# Altium schematic sheet Main.SchDoc
size A1
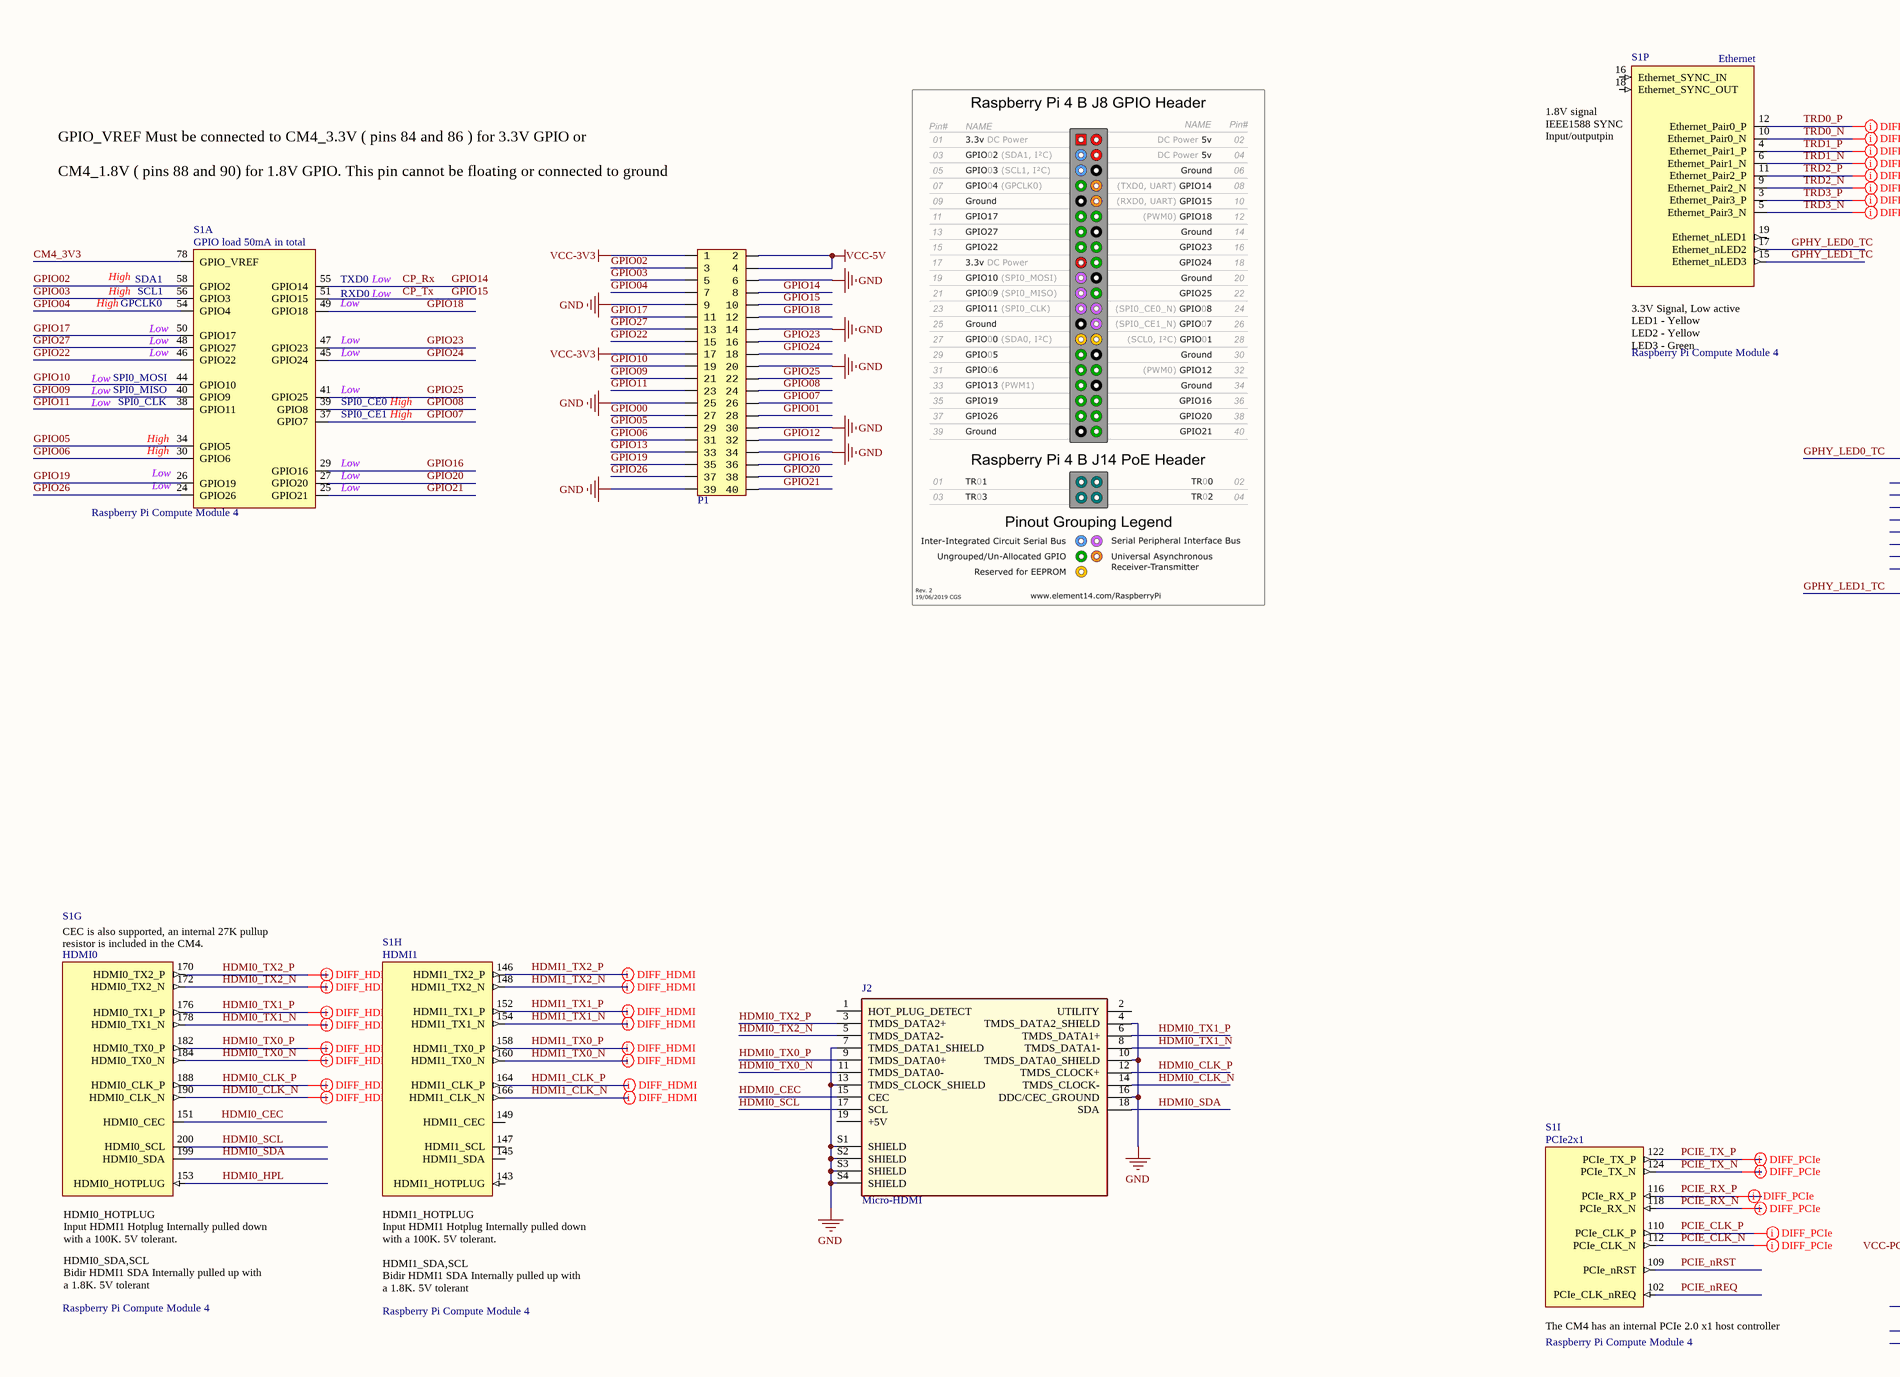
[diagram p0: Main.SchDoc, top left]
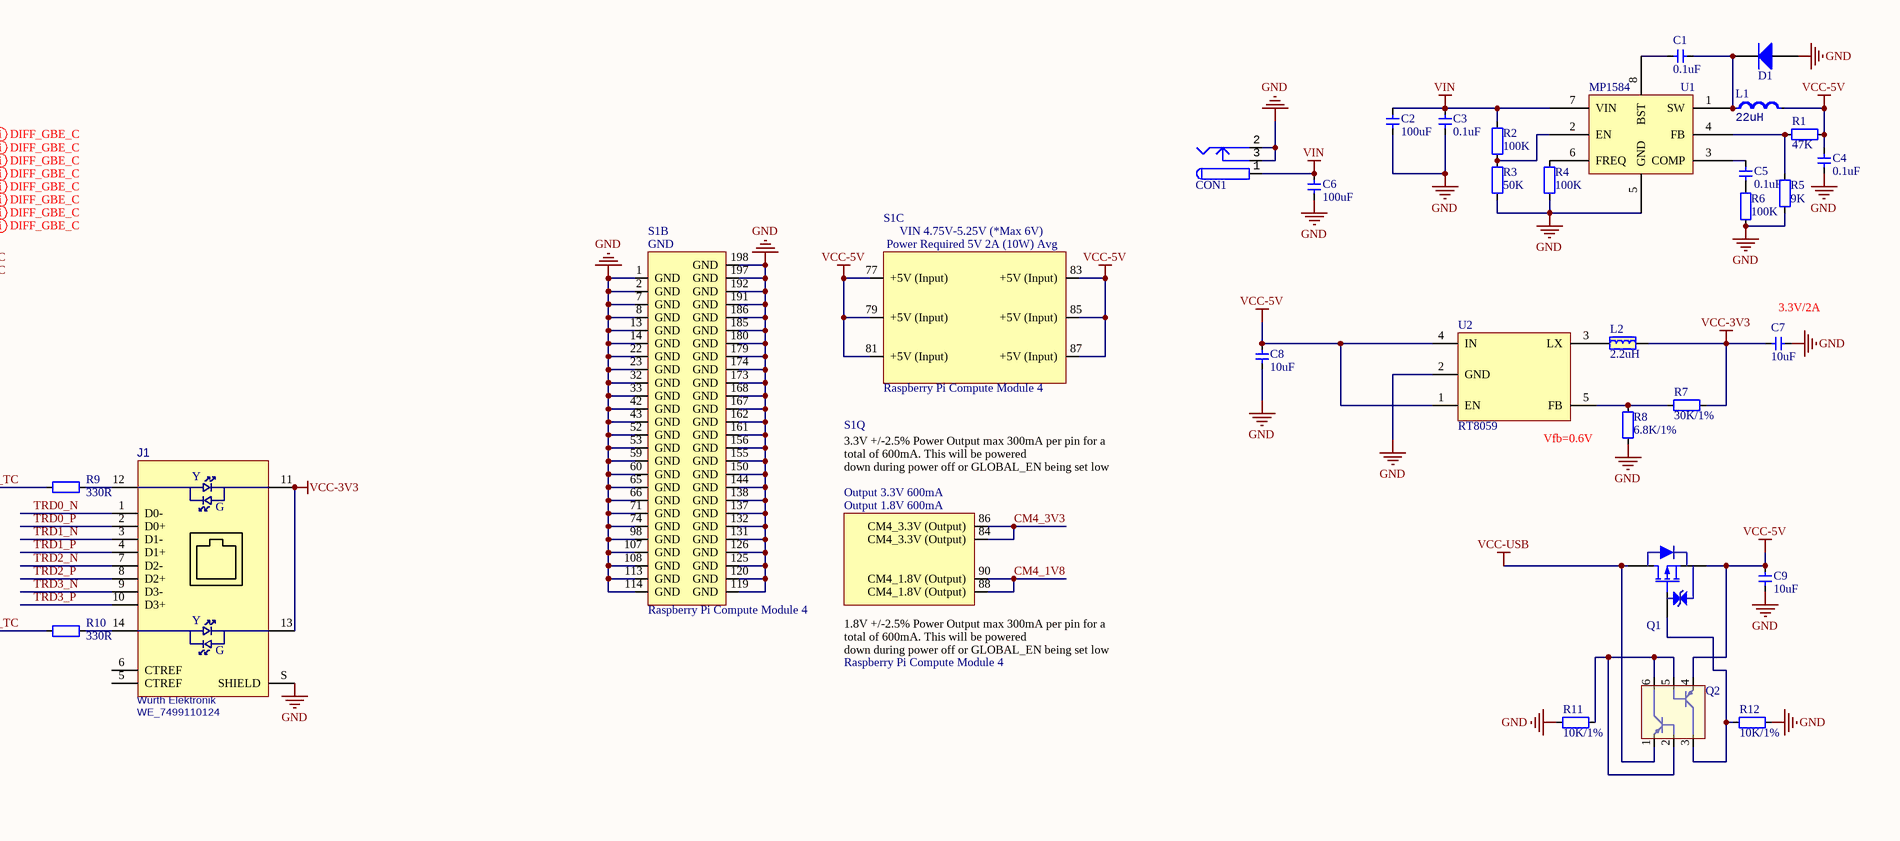
[diagram p1: Main.SchDoc, top right]
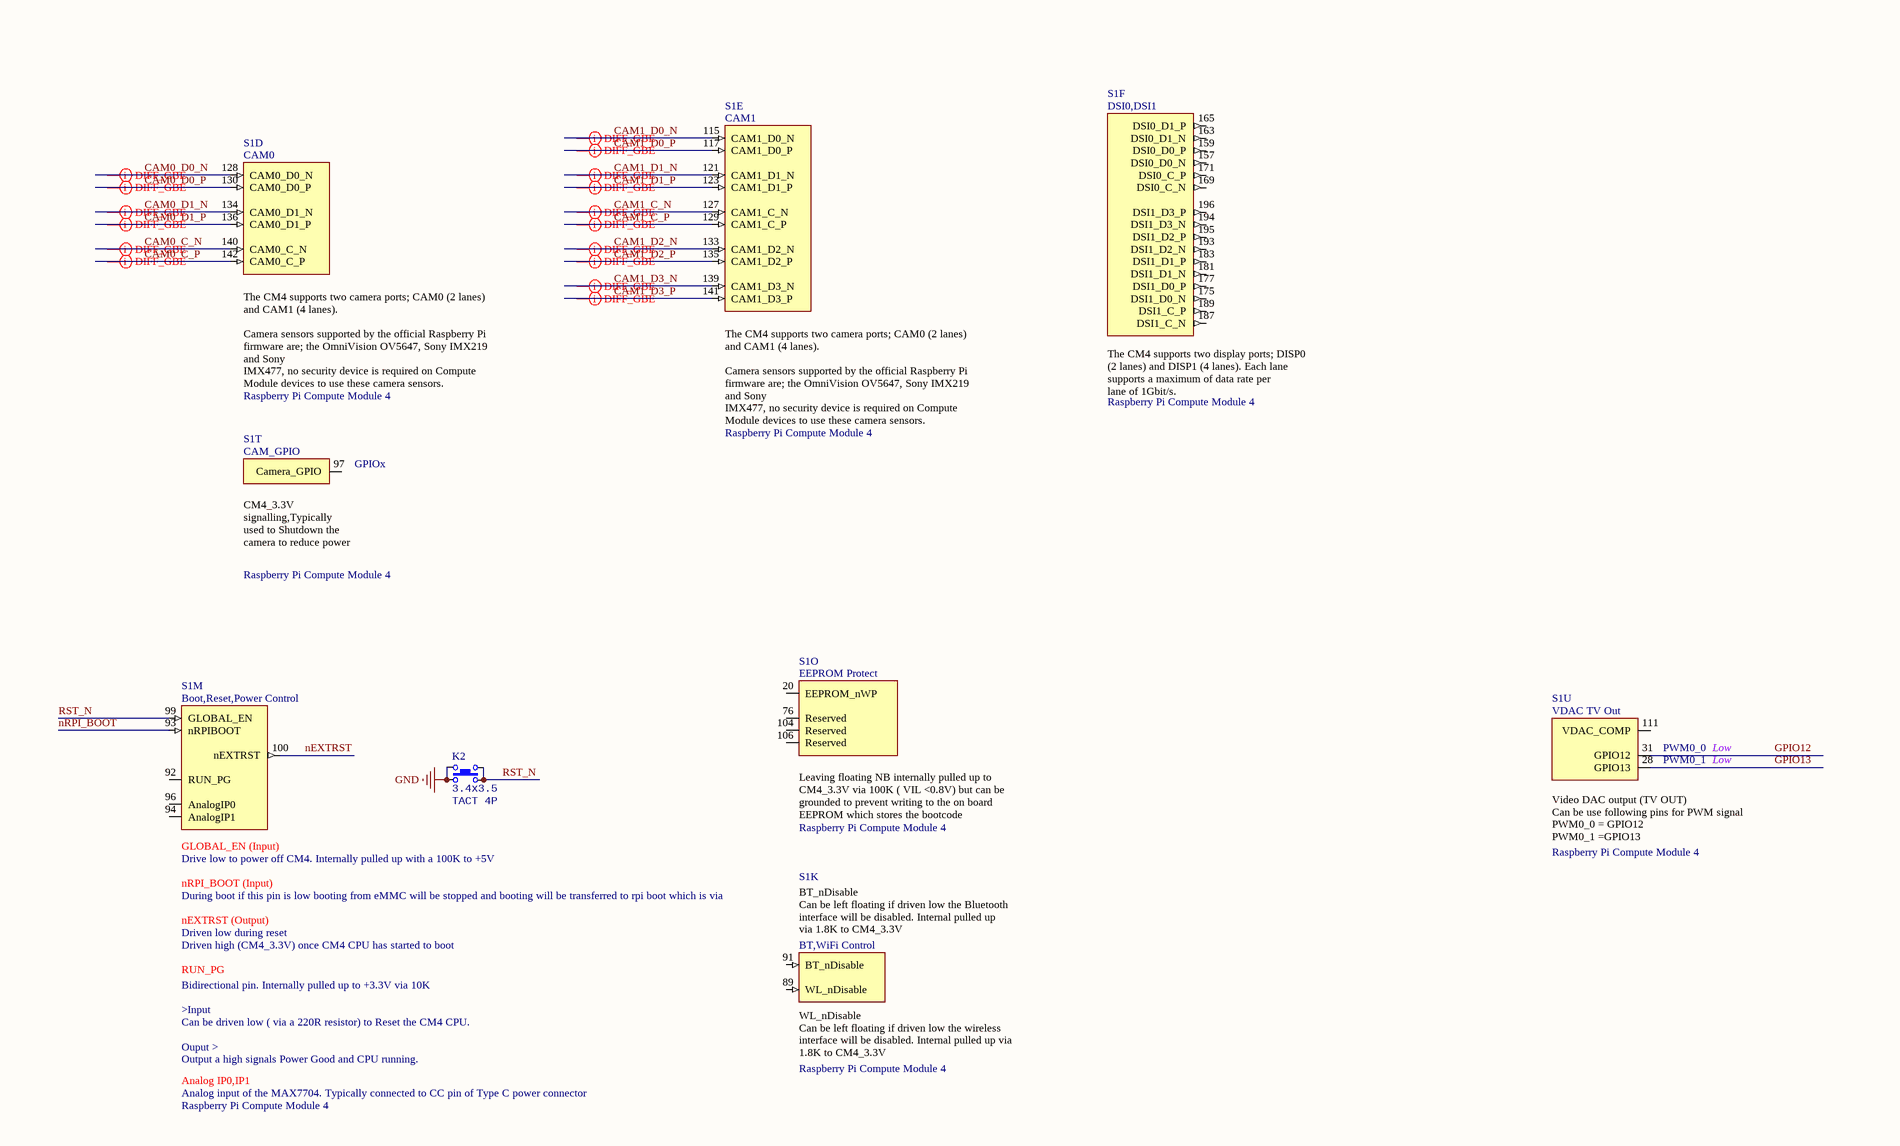
[diagram p2: Main.SchDoc, bottom left]
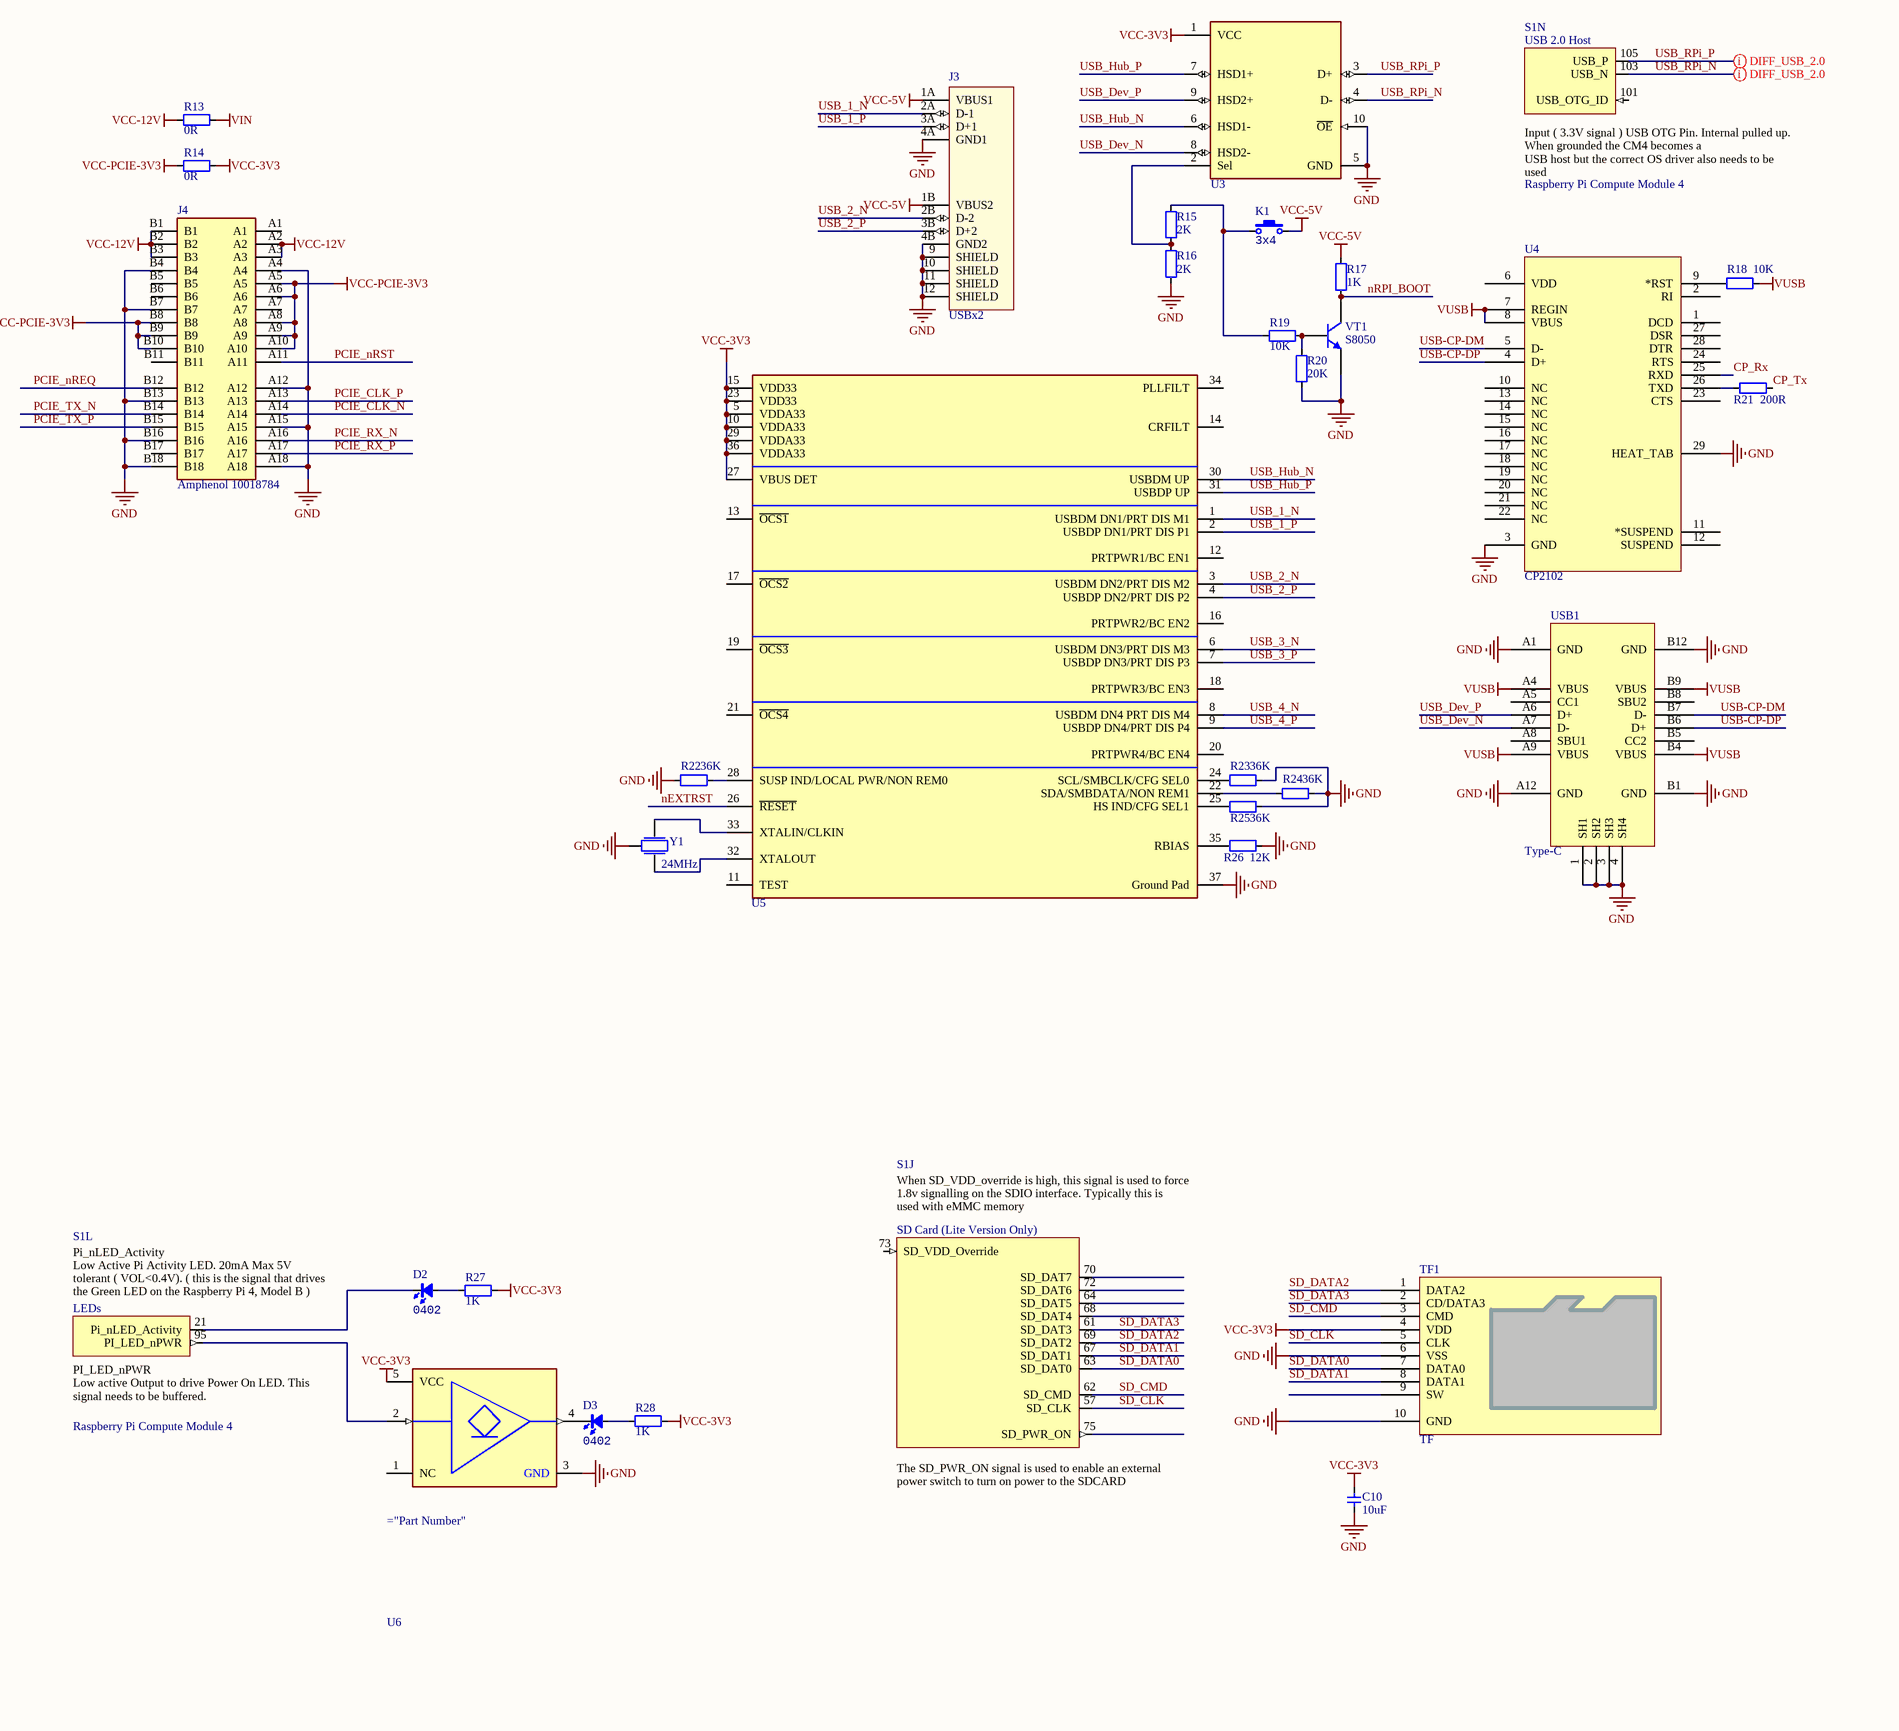
[diagram p3: Main.SchDoc, bottom right]

## Parts
C1  0.1uF  [CAP_0402]
C2  100uF  [1206-CAP]
C3  0.1uF  [CAP_0402]
C4  0.1uF  [CAP_0402]
C5  0.1uF  [CAP_0402]
C6  100uF  [1206-CAP]
C7  10uF  [CAP_0402]
C8  10uF  [CAP_0402]
C9  10uF  [CAP_0402]
C10  10uF  [CAP_0402]
CON1  PowerJack_2.5  [KLD_0202]  (value not drawn)
D1  MBR140SFT1G  [DIOM2717X10N]  (value not drawn)
D2  Type: 0402  [LED_0402_GREEN]  (hidden comment: color?)
D3  Type: 0402  [LED_0402_RED]  (hidden comment: color?)
J1  Manufacturer: Wurth Elektronik  [GE-SOCKET]  (hidden comment: WE_7499110124)
J2  Micro-HDMI  [MICRO HDMI]
J3  USBx2  [USBx2]
J4  Amphenol 10018784  [PCIE-1X-Connector]
K1  value 3x4  [ButtonTACT_3x4x2_180H]  (hidden comment: TACT 2P)
K2  value 3.4x3.5  [ButtonTACT_3.5*3.55_90]  (hidden comment: TACT 4P)
L1  value 22uH  [IND_CD32]  (hidden comment: CD32)
L2  2.2uH  [2520-L]
P1  HDR2x20_2.54  [HDR2X20_2.54_180]  (value not drawn)
Q1  AO3415A  [SOT23-3]  (value not drawn)
Q2  BCM856BS  [SOT363-6]  (value not drawn)
R1  47K  [RES_0402]
R2  100K  [RES_0402]
R3  50K  [RES_0402]
R4  100K  [RES_0402]
R5  9K  [RES_0402]
R6  100K  [RES_0402]
R7  30K/1%  [RES_0402]
R8  6.8K/1%  [RES_0402]
R9  330R  [RES_0402]
R10  330R  [RES_0402]
R11  10K/1%  [RES_0402]
R12  10K/1%  [RES_0402]
R13  0R  [RES_0402]
R14  0R  [RES_0402]
R15  2K  [RES_0402]
R16  2K  [RES_0402]
R17  1K  [RES_0402]
R18  10K  [RES_0402]
R19  10K  [RES_0402]
R20  20K  [RES_0402]
R21  200R  [RES_0402]
R22  36K  [RES_0402]
R23  36K  [RES_0402]
R24  36K  [RES_0402]
R25  36K  [RES_0402]
R26  12K  [RES_0402]
R27  1K  [RES_0402]
R28  1K  [RES_0402]
S1  Raspberry Pi Compute Module 4  [CM4-DF40HC(3.0)-100DS-0.4v_3mm_1.5mm]  (parts A,B,C,D,E,F,G,H,I,J,K,L,M,N,O,P,Q,T,U of 21)
TF1  TF  [TF-SOCKET]
U1  MP1584  [SO-8]
U2  RT8059  [SOT23-5]
U3  FSUSB42MUX  [MSOP-10]  (value not drawn)
U4  CP2102  [QFN-28]
U5  USB2514BT-I-M2  [QFN-36]  (value not drawn)
U6  74LVC1G07SE-7  [SOT353-5]  (value not drawn)
USB1  Type-C  [Type-C-TOP]
VT1  S8050  [SMT_TRIODE_NPN]
Y1  24MHz  [晶振-3P]

## Nets
GND: C2.1 C3.1 C4.1 C6.1 C7.1 C8.1 C9.1 C10.1 CON1.2 CON1.3 D1.A J1.S(SHIELD) J2.4(TMDS_DATA2_SHIELD) J2.7(TMDS_DATA1_SHIELD) J2.10(TMDS_DATA0_SHIELD) J2.13(TMDS_CLOCK_SHIELD) J2.16(DDC/CEC_GROUND) J2.S1(SHIELD) J2.S2(SHIELD) J2.S3(SHIELD) J2.S4(SHIELD) J3.4A(GND1) J3.4B(GND2) J3.9(SHIELD) J3.10(SHIELD) J3.11(SHIELD) J3.12(SHIELD) J4.A4 J4.A12 J4.A15 J4.A18 J4.B4 J4.B7 J4.B13 J4.B16 J4.B18 K2.1 K2.3 P1.6 P1.9 P1.14 P1.20 P1.25 P1.30 P1.34 P1.39 R3.2 R4.2 R5.2 R6.2 R8.1 R11.1 R12.2 R16.2 R20.1 R22.2 R23.1 R24.1 R25.1 R26.1 S1.1(GND) S1.2(GND) S1.7(GND) S1.8(GND) S1.13(GND) S1.14(GND) S1.22(GND) S1.23(GND) S1.32(GND) S1.33(GND) S1.42(GND) S1.43(GND) S1.52(GND) S1.53(GND) S1.59(GND) S1.60(GND) S1.65(GND) S1.66(GND) S1.71(GND) S1.74(GND) S1.98(GND) S1.107(GND) S1.108(GND) S1.113(GND) S1.114(GND) S1.119(GND) S1.120(GND) S1.125(GND) S1.126(GND) S1.131(GND) S1.132(GND) S1.137(GND) S1.138(GND) S1.144(GND) S1.150(GND) S1.155(GND) S1.156(GND) S1.161(GND) S1.162(GND) S1.167(GND) S1.168(GND) S1.173(GND) S1.174(GND) S1.179(GND) S1.180(GND) S1.185(GND) S1.186(GND) S1.191(GND) S1.192(GND) S1.197(GND) S1.198(GND) TF1.6(VSS) TF1.10(GND) U1.5(GND) U2.2(GND) U3.5(GND) U3.10(~{OE}) U4.3(GND) U4.29(HEAT_TAB) U5.37(Ground_Pad) USB1.1(SH1) USB1.2(SH2) USB1.3(SH3) USB1.4(SH4) USB1.A1(GND) USB1.A12(GND) USB1.B1(GND) USB1.B12(GND) VT1.2(E) Y1.2
VCC-3V3: C7.2 C10.2 J1.11 J1.13 L2.2 P1.1 P1.17 R7.1 R14.1 R27.1 R28.1 TF1.4(VDD) U3.1(VCC) U5.5(VDDA33) U5.10(VDDA33) U5.15(VDD33) U5.23(VDD33) U5.27(VBUS_DET) U5.29(VDDA33) U5.36(VDDA33) U6.5(VCC)
VCC-5V: C4.2 C8.2 C9.2 J3.1A(VBUS1) J3.1B(VBUS2) K1.2 L1.2 P1.2 P1.4 Q1.2(S) Q2.4 R1.2 R17.1 S1.77(+5V_(Input)) S1.79(+5V_(Input)) S1.81(+5V_(Input)) S1.83(+5V_(Input)) S1.85(+5V_(Input)) S1.87(+5V_(Input)) U2.1(EN) U2.4(IN)
VCC-12V: J4.A2 J4.A3 J4.B1 J4.B2 J4.B3 R13.2
VCC-PCIE-3V3: J4.A5 J4.A6 J4.A8 J4.A9 J4.A10 J4.B8 J4.B9 J4.B10 R14.2
VCC-USB: Q1.3(D) Q2.1
VIN: C2.2 C3.2 C6.2 CON1.1 R2.1 R13.1 U1.7(VIN)
VUSB: R18.1 U4.7(REGIN) U4.8(VBUS) USB1.A4(VBUS) USB1.A9(VBUS) USB1.B4(VBUS) USB1.B9(VBUS)
CAM0_C_N: S1.140(CAM0_C_N)
CAM0_C_P: S1.142(CAM0_C_P)
CAM0_D0_N: S1.128(CAM0_D0_N)
CAM0_D0_P: S1.130(CAM0_D0_P)
CAM0_D1_N: S1.134(CAM0_D1_N)
CAM0_D1_P: S1.136(CAM0_D1_P)
CAM1_C_N: S1.127(CAM1_C_N)
CAM1_C_P: S1.129(CAM1_C_P)
CAM1_D0_N: S1.115(CAM1_D0_N)
CAM1_D0_P: S1.117(CAM1_D0_P)
CAM1_D1_N: S1.121(CAM1_D1_N)
CAM1_D1_P: S1.123(CAM1_D1_P)
CAM1_D2_N: S1.133(CAM1_D2_N)
CAM1_D2_P: S1.135(CAM1_D2_P)
CAM1_D3_N: S1.139(CAM1_D3_N)
CAM1_D3_P: S1.141(CAM1_D3_P)
CM4_1V8: S1.88(CM4_1.8V_(Output)) S1.90(CM4_1.8V_(Output))
CM4_3V3: S1.78(GPIO_VREF) S1.84(CM4_3.3V_(Output)) S1.86(CM4_3.3V_(Output))
CP_Rx: P1.8 S1.55(GPIO14) U4.25(RXD)  [also labelled GPIO14]
CP_Tx: P1.10 R21.1 S1.51(GPIO15)  [also labelled GPIO15]
GPHY_LED0_TC: R9.2 S1.17(Ethernet_nLED2)
GPHY_LED1_TC: R10.2 S1.15(Ethernet_nLED3)
GPIO00: P1.27
GPIO01: P1.28
GPIO02: P1.3 S1.58(GPIO2)
GPIO03: P1.5 S1.56(GPIO3)
GPIO04: P1.7 S1.54(GPIO4)
GPIO05: P1.29 S1.34(GPIO5)
GPIO06: P1.31 S1.30(GPIO6)
GPIO07: P1.26 S1.37(GPIO7)
GPIO08: P1.24 S1.39(GPIO8)
GPIO09: P1.21 S1.40(GPIO9)
GPIO10: P1.19 S1.44(GPIO10)
GPIO11: P1.23 S1.38(GPIO11)
GPIO12: P1.32 S1.31(GPIO12)
GPIO13: P1.33 S1.28(GPIO13)
GPIO16: P1.36 S1.29(GPIO16)
GPIO17: P1.11 S1.50(GPIO17)
GPIO18: P1.12 S1.49(GPIO18)
GPIO19: P1.35 S1.26(GPIO19)
GPIO20: P1.38 S1.27(GPIO20)
GPIO21: P1.40 S1.25(GPIO21)
GPIO22: P1.15 S1.46(GPIO22)
GPIO23: P1.16 S1.47(GPIO23)
GPIO24: P1.18 S1.45(GPIO24)
GPIO25: P1.22 S1.41(GPIO25)
GPIO26: P1.37 S1.24(GPIO26)
GPIO27: P1.13 S1.48(GPIO27)
HDMI0_CEC: J2.15(CEC) S1.151(HDMI0_CEC)
HDMI0_CLK_N: J2.14(TMDS_CLOCK-) S1.190(HDMI0_CLK_N)
HDMI0_CLK_P: J2.12(TMDS_CLOCK+) S1.188(HDMI0_CLK_P)
HDMI0_HPL: S1.153(HDMI0_HOTPLUG)
HDMI0_SCL: J2.17(SCL) S1.200(HDMI0_SCL)
HDMI0_SDA: J2.18(SDA) S1.199(HDMI0_SDA)
HDMI0_TX0_N: J2.11(TMDS_DATA0-) S1.184(HDMI0_TX0_N)
HDMI0_TX0_P: J2.9(TMDS_DATA0+) S1.182(HDMI0_TX0_P)
HDMI0_TX1_N: J2.8(TMDS_DATA1-) S1.178(HDMI0_TX1_N)
HDMI0_TX1_P: J2.6(TMDS_DATA1+) S1.176(HDMI0_TX1_P)
HDMI0_TX2_N: J2.5(TMDS_DATA2-) S1.172(HDMI0_TX2_N)
HDMI0_TX2_P: J2.3(TMDS_DATA2+) S1.170(HDMI0_TX2_P)
HDMI1_CLK_N: S1.166(HDMI1_CLK_N)
HDMI1_CLK_P: S1.164(HDMI1_CLK_P)
HDMI1_TX0_N: S1.160(HDMI1_TX0_N)
HDMI1_TX0_P: S1.158(HDMI1_TX0_P)
HDMI1_TX1_N: S1.154(HDMI1_TX1_N)
HDMI1_TX1_P: S1.152(HDMI1_TX1_P)
HDMI1_TX2_N: S1.148(HDMI1_TX2_N)
HDMI1_TX2_P: S1.146(HDMI1_TX2_P)
nEXTRST: S1.100(nEXTRST) U5.26(~{RESET})
nRPI_BOOT: R17.2 S1.93(nRPIBOOT) VT1.3(C)
PCIE_CLK_N: J4.A14 S1.112(PCIe_CLK_N)
PCIE_CLK_P: J4.A13 S1.110(PCIe_CLK_P)
PCIE_nREQ: J4.B12 S1.102(PCIe_CLK_nREQ)
PCIE_nRST: J4.A11 S1.109(PCIe_nRST)
PCIE_RX_N: J4.A16 S1.118(PCIe_RX_N)
PCIE_RX_P: J4.A17 S1.116(PCIe_RX_P)
PCIE_TX_N: J4.B14 S1.124(PCIe_TX_N)
PCIE_TX_P: J4.B15 S1.122(PCIe_TX_P)
RST_N: K2.2 K2.4 S1.99(GLOBAL_EN)
SD_CLK: S1.57(SD_CLK) TF1.5(CLK)
SD_CMD: S1.62(SD_CMD) TF1.3(CMD)
SD_DATA0: S1.63(SD_DAT0) TF1.7(DATA0)
SD_DATA1: S1.67(SD_DAT1) TF1.8(DATA1)
SD_DATA2: S1.69(SD_DAT2) TF1.1(DATA2)
SD_DATA3: S1.61(SD_DAT3) TF1.2(CD/DATA3)
TRD0_N: J1.1(D0-) S1.10(Ethernet_Pair0_N)
TRD0_P: J1.2(D0+) S1.12(Ethernet_Pair0_P)
TRD1_N: J1.3(D1-) S1.6(Ethernet_Pair1_N)
TRD1_P: J1.4(D1+) S1.4(Ethernet_Pair1_P)
TRD2_N: J1.7(D2-) S1.9(Ethernet_Pair2_N)
TRD2_P: J1.8(D2+) S1.11(Ethernet_Pair2_P)
TRD3_N: J1.9(D3-) S1.5(Ethernet_Pair3_N)
TRD3_P: J1.10(D3+) S1.3(Ethernet_Pair3_P)
USB-CP-DM: U4.5(D-) USB1.B7(D-)
USB-CP-DP: U4.4(D+) USB1.B6(D+)
USB_1_N: J3.2A(D-1) U5.1(USBDM_DN1/PRT_DIS_M1)
USB_1_P: J3.3A(D+1) U5.2(USBDP_DN1/PRT_DIS_P1)
USB_2_N: J3.2B(D-2) U5.3(USBDM_DN2/PRT_DIS_M2)
USB_2_P: J3.3B(D+2) U5.4(USBDP_DN2/PRT_DIS_P2)
USB_3_N: U5.6(USBDM_DN3/PRT_DIS_M3)
USB_3_P: U5.7(USBDP_DN3/PRT_DIS_P3)
USB_4_N: U5.8(USBDM_DN4_PRT_DIS_M4)
USB_4_P: U5.9(USBDP_DN4/PRT_DIS_P4)
USB_Dev_N: U3.8(HSD2-) USB1.A7(D-)
USB_Dev_P: U3.9(HSD2+) USB1.A6(D+)
USB_Hub_N: U3.6(HSD1-) U5.30(USBDM_UP)
USB_Hub_P: U3.7(HSD1+) U5.31(USBDP_UP)
USB_RPi_N: S1.103(USB_N) U3.4(D-)
USB_RPi_P: S1.105(USB_P) U3.3(D+)
NetC1_1: C1.1 D1.K L1.1 U1.1(SW)
NetC1_2: C1.2 U1.8(BST)
NetC5_1: C5.1 R6.1
NetC5_2: C5.2 U1.3(COMP)
NetD2_1: D2.1(A) R27.2
NetD2_2: D2.2(K) S1.21(Pi_nLED_Activity)
NetD3_1: D3.1(A) R28.2
NetD3_2: D3.2(K) U6.4(Y)
NetJ1_12: J1.12 R9.1
NetJ1_14: J1.14 R10.1
NetK1_1: K1.1 R15.1 R19.1
NetL2_1: L2.1 U2.3(LX)
NetQ1_1: Q1.1(G) Q2.3 R12.1
NetQ2_2: Q2.2 Q2.5 Q2.6 R11.2
NetR1_1: R1.1 R5.1 U1.4(FB)
NetR2_2: R2.2 R3.1 U1.2(EN)
NetR4_1: R4.1 U1.6(FREQ)
NetR7_2: R7.2 R8.2 U2.5(FB)
NetR15_2: R15.2 R16.1 U3.2(Sel)
NetR18_2: R18.2 U4.9(*RST)
NetR19_2: R19.2 R20.2 VT1.1(B)
NetR21_2: R21.2 U4.26(TXD)
NetR22_1: R22.1 U5.28(SUSP_IND/LOCAL_PWR/NON_REM0)
NetR23_2: R23.2 U5.24(SCL/SMBCLK/CFG_SEL0)
NetR24_2: R24.2 U5.22(SDA/SMBDATA/NON_REM1)
NetR25_2: R25.2 U5.25(HS_IND/CFG_SEL1)
NetR26_2: R26.2 U5.35(RBIAS)
NetS1_95: S1.95(PI_LED_nPWR) U6.2(A)
NetU5_32: U5.32(XTALOUT) Y1.1
NetU5_33: U5.33(XTALIN/CLKIN) Y1.3

Not connected (* = marked no-connect by the designer): J1 5(CTREF) 6(CTREF); J2 1(HOT_PLUG_DETECT) 2(UTILITY) 19(+5V); J4 A1 A7 B5 B6 B11 B17; S1 16(Ethernet_SYNC_IN) 18(Ethernet_SYNC_OUT) 19(Ethernet_nLED1) 20(EEPROM_nWP) 64(SD_DAT5) 68(SD_DAT4) 70(SD_DAT7) 72(SD_DAT6) 73(SD_VDD_Override) 75(SD_PWR_ON) 76(Reserved) 89(WL_nDisable) 91(BT_nDisable) 92(RUN_PG) 94(AnalogIP1) 96(AnalogIP0) 97(Camera_GPIO) 101(USB_OTG_ID) 104(Reserved) 106(Reserved) 111(VDAC_COMP) 143(HDMI1_HOTPLUG) 145(HDMI1_SDA) 147(HDMI1_SCL) 149(HDMI1_CEC) 157(DSI0_D0_N) 159(DSI0_D0_P) 163(DSI0_D1_N) 165(DSI0_D1_P) 169(DSI0_C_N) 171(DSI0_C_P) 175(DSI1_D0_N) 177(DSI1_D0_P) 181(DSI1_D1_N) 183(DSI1_D1_P) 187(DSI1_C_N) 189(DSI1_C_P) 193(DSI1_D2_N) 194(DSI1_D3_N) 195(DSI1_D2_P) 196(DSI1_D3_P); TF1 9(SW); U4 1(DCD) 2(RI) 6(VDD) 10(NC) 11(*SUSPEND) 12(SUSPEND) 13(NC) 14(NC) 15(NC) 16(NC) 17(NC) 18(NC) 19(NC) 20(NC) 21(NC) 22(NC) 23(CTS) 24(RTS) 27(DSR) 28(DTR); U5 11(TEST) 12(PRTPWR1/BC_EN1) 13(~{OCS1}) 14(CRFILT) 16(PRTPWR2/BC_EN2) 17(~{OCS2}) 18(PRTPWR3/BC_EN3) 19(~{OCS3}) 20(PRTPWR4/BC_EN4) 21(~{OCS4}) 34(PLLFILT); U6 1(NC) 3(GND); USB1 A5(CC1) A8(SBU1) B5(CC2) B8(SBU2)

## Layout directives
differential pair; differential pair class DIFF_100Ohm_HDMI; differential pair class DIFF_HDMI; net class HDMI_18Gbps: HDMI0_CLK_N, HDMI0_CLK_P, HDMI0_TX0_N, HDMI0_TX0_P, HDMI0_TX1_N, HDMI0_TX1_P, HDMI0_TX2_N, HDMI0_TX2_P, HDMI1_CLK_N, HDMI1_CLK_P, HDMI1_TX0_N, HDMI1_TX0_P, HDMI1_TX1_N, HDMI1_TX1_P, HDMI1_TX2_N, HDMI1_TX2_P
differential pair; differential pair class DIFF_100Ohm_MIPI; differential pair class DIFF_MIPI; net class MIPI_1Gbps: CAM0_C_N, CAM0_C_P, CAM0_D0_N, CAM0_D0_P, CAM0_D1_N, CAM0_D1_P, CAM1_C_N, CAM1_C_P, CAM1_D0_N, CAM1_D0_P, CAM1_D1_N, CAM1_D1_P, CAM1_D2_N, CAM1_D2_P, CAM1_D3_N, CAM1_D3_P
differential pair; differential pair class DIFF_100Ohm_GBE; differential pair class DIFF_LAN_GB; net class GBE_1Gbps: TRD0_N, TRD0_P, TRD1_N, TRD1_P, TRD2_N, TRD2_P, TRD3_N, TRD3_P
differential pair; differential pair class DIFF_90Ohm_USB2.0; differential pair class DIFF_USB2.0; net class USB2.0_480Mbps: USB_RPi_N, USB_RPi_P
differential pair; differential pair class DIFF_90Ohm_PCIe; differential pair class DIFF_PCIe; net class PCIe_5Gbps: PCIE_CLK_N, PCIE_CLK_P, PCIE_RX_N, PCIE_RX_P, PCIE_TX_N, PCIE_TX_P

## Notes on the sheet
- GPIO_VREF Must be connected to CM4_3.3V ( pins 84 and 86 ) for 3.3V GPIO or
  CM4_1.8V ( pins 88 and 90) for 1.8V GPIO. This pin cannot be floating or connected to ground
- (near C7) 3.3V/2A
- Vfb=0.6V
- Labels drawn without touching a wire or pin: GND
- (in symbol CM4, part A) GPIO load 50mA in total; High; SDA1; TXD0; Low; SCL1; RXD0; GPCLK0; SPI0_MOSI; SPI0_MISO; SPI0_CLK; SPI0_CE0; SPI0_CE1
- (in symbol CM4, part C) VIN 4.75V-5.25V (*Max 6V); Power Required 5V 2A (10W) Avg; by Amornthep Phunsin
- (in symbol CM4, part D) CAM0; The CM4 supports two camera ports; CAM0 (2 lanes) and CAM1 (4 lanes). / Camera sensors supported by the official Raspberry Pi firmware are; the OmniVision OV5647, Sony IMX219 and Sony / IMX477, no security device is required on Compute Module devices to use these camera sensors.
- (in symbol CM4, part E) CAM1; The CM4 supports two camera ports; CAM0 (2 lanes) and CAM1 (4 lanes). / Camera sensors supported by the official Raspberry Pi firmware are; the OmniVision OV5647, Sony IMX219 and Sony / IMX477, no security device is required on Compute Module devices to use these camera sensors.
- (in symbol CM4, part F) DSI0,DSI1; The CM4 supports two display ports; DISP0 (2 lanes) and DISP1 (4 lanes). Each lane supports a maximum of data rate per / lane of 1Gbit/s.
- (in symbol CM4, part G) HDMI0; CEC is also supported, an internal 27K pullup resistor is included in the CM4.; HDMI0_HOTPLUG / Input HDMI1 Hotplug Internally pulled down with a 100K. 5V tolerant.; HDMI0_SDA,SCL / Bidir HDMI1 SDA Internally pulled up with a 1.8K. 5V tolerant
- (in symbol CM4, part H) HDMI1; HDMI1_HOTPLUG / Input HDMI1 Hotplug Internally pulled down with a 100K. 5V tolerant.; HDMI1_SDA,SCL / Bidir HDMI1 SDA Internally pulled up with a 1.8K. 5V tolerant
- (in symbol CM4, part I) PCIe2x1; The CM4 has an internal PCIe 2.0 x1 host controller
- (in symbol CM4, part J) When SD_VDD_override is high, this signal is used to force 1.8v signalling on the SDIO interface. Typically this is / used with eMMC memory; SD Card (Lite Version Only); by Amornthep Phunsin; The SD_PWR_ON signal is used to enable an external power switch to turn on power to the SDCARD
- (in symbol CM4, part K) BT_nDisable / Can be left floating if driven low the Bluetooth interface will be disabled. Internal pulled up / via 1.8K to CM4_3.3V; BT,WiFi Control; WL_nDisable / Can be left floating if driven low the wireless interface will be disabled. Internal pulled up via / 1.8K to CM4_3.3V
- (in symbol CM4, part L) Pi_nLED_Activity / Low Active Pi Activity LED. 20mA Max 5V tolerant ( VOL<0.4V). ( this is the signal that drives / the Green LED on the Raspberry Pi 4, Model B ); LEDs; PI_LED_nPWR / Low active Output to drive Power On LED. This signal needs to be buffered.
- (in symbol CM4, part M) Boot,Reset,Power Control; GLOBAL_EN (Input); Drive low to power off CM4. Internally pulled up with a 100K to +5V; nRPI_BOOT (Input); During boot if this pin is low booting from eMMC will be stopped and booting will be transferred to rpi boot which is via; nEXTRST (Output); Driven low during reset; Driven high (CM4_3.3V) once CM4 CPU has started to boot; Bidirectional pin. Internally pulled up to +3.3V via 10K / >Input / Can be driven low ( via a 220R resistor) to Reset the CM4 CPU. / Ouput > / Output a high signals Power Good and CPU running.; Analog IP0,IP1; Analog input of the MAX7704. Typically connected to CC pin of Type C power connector
- (in symbol CM4, part N) USB 2.0 Host; Input ( 3.3V signal ) USB OTG Pin. Internal pulled up. When grounded the CM4 becomes a / USB host but the correct OS driver also needs to be used
- (in symbol CM4, part O) EEPROM Protect; Leaving floating NB internally pulled up to CM4_3.3V via 100K ( VIL <0.8V) but can be / grounded to prevent writing to the on board EEPROM which stores the bootcode
- (in symbol CM4, part P) Ethernet; 1.8V signal / IEEE1588 SYNC Input/outputpin; by Amornthep Phunsin; 3.3V Signal, Low active / LED1 - Yellow / LED2 - Yellow / LED3 - Green
- (in symbol CM4, part Q) 3.3V +/-2.5% Power Output max 300mA per pin for a total of 600mA. This will be powered / down during power off or GLOBAL_EN being set low; Output 3.3V 600mA; Output 1.8V 600mA; 1.8V +/-2.5% Power Output max 300mA per pin for a total of 600mA. This will be powered / down during power off or GLOBAL_EN being set low
- (in symbol CM4, part T) CAM_GPIO; GPIOx; CM4_3.3V signalling,Typically used to Shutdown the camera to reduce power
- (in symbol CM4, part U) VDAC TV Out; PWM0_0; Low; PWM0_1; Video DAC output (TV OUT) / Can be use following pins for PWM signal / PWM0_0 = GPIO12 / PWM0_1 =GPIO13
- (in symbol GE-SOCKET) Y; G

## Library data of the parts
C1 C3-C5 C7-C10 = 电容-0402: Capacitor; Value: 0.1u
C2 C6 = 电容-1206: Capacitor; Value: 0.1u
CON1 = PowerJack_2.5: DC Power Jack
D1 = MBR140SFT1G: Rectifier Diode, Single, 40 V, 1 A, SOD-123FL, 2, 550 mV
D2 D3 = LED_0402: LED; Value: color?
J1 = GE-SOCKET: LAN-Transformer WE-RJ45LAN 10/100/1000 BaseT; PartNumber: WE_7499110124; Value: WE_7499110124; PartSymbol: WE_7499110124
J2 = Micro-HDMI: Conn Micro HDMI RCP 19 POS 0.4mm Solder RA SMD 19 Terminal 1 Port Micro HDMI Embossed T/R; MF: Molex; MP: 0467650301; Package: None; Availability: Unavailable; SnapEDA_Link: https://www.snapeda.com/parts/0467650301/Molex/view-part/?ref=snap; Price: None; Value: *
J3 = USBx2: Usb Conn, Dual Rcpt, 2.0, 2port, 8pos; MF: Global Connector Technology; MP: USB1035-GF-P-0-B-B; Availability: Good; Price: 0.42 USD; SnapEDA_Link: https://www.snapeda.com/parts/USB1035-GF-P-0-B-B/Global%20Connector%20Technology/view-part/?ref=snap; Package: None; Value: *
J4 = PCIE-1X-Connector: 36 Position Female Connector Amphenol 10018784-10210TLF; MF: Amphenol ICC; Price: None; SnapEDA_Link: https://www.snapeda.com/parts/10018784-10210TLF/Amphenol%20FCI/view-part/520950/?ref=snap; Availability: Unavailable; MP: 10018784-10210TLF; Package: None; Value: *
K1 = ButtonTACT_3x4x2_180: Button; type: TACT 2P
K2 = ButtonTACT: Button; type: TACT 4P
L1 = Ind_CD32: Inductor; Specification: ±5% 100mA; Manufacturer: *; Type: CD32
L2 = 电感-2520: 磁珠
P1 = HDR2x20_2.54: Header
Q1 = AO3415A: MOSFET; Published: 8-Jun-2000; LatestRevisionDate: 17-Jul-2002; LatestRevisionNote: Re-released for DXP Platform.; PackageVersion: 1995/1996; PackageReference: E3; Publisher: Altium Limited; PackageDescription: TO, Flat Index; 3 In-Line, Axial Leads; Body Dia. 4.6mm; Lead Dia. 0.5 mm (max)
Q2 = BCM856BS: Transistor
R1-R28 = 电阻-0402: Resistor; Value: 22R
S1 = CM4: Raspberry Pi Compute Module 4 by Amornthep Phunsin
TF1 = TF卡座: 8脚自弹
U1 = MP1584: 电源芯片
U2 = RT8059: LDO
U4 = CP2102: USB转TTL; PART DESC: SINGLE-CHIP USB TO UART BRIDGE, QFN28, RoHS.; MFG #1: SILICON LABS; PART NUMBER: CP2102; Value: Value; RefDes: RefDes; Type: DEV
USB1 = USB-Type-C-TOP
VT1 = SMT_TRIODE_NPN: Surface mount NPN transistor, package SOT-23
Y1 = 晶振-3Pin: 村田贴片